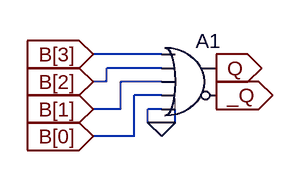
[diagram p0: schematic 4bit_or-fast.asc]
4bit_or-fast.asc, the LTspice schematic file:
Version 4
SHEET 1 880 680
WIRE 64 96 -16 96
WIRE 64 112 0 112
WIRE 0 128 0 112
WIRE 0 128 -16 128
WIRE 64 128 16 128
WIRE 64 144 32 144
WIRE 16 160 16 128
WIRE 16 160 -16 160
WIRE 64 160 48 160
WIRE 48 176 48 160
WIRE 64 176 48 176
WIRE 80 176 80 160
WIRE 80 176 64 176
WIRE 32 192 32 144
WIRE 32 192 -16 192
FLAG 128 112 Q
IOPIN 128 112 Out
FLAG -16 96 B[3]
IOPIN -16 96 In
FLAG -16 128 B[2]
IOPIN -16 128 In
FLAG -16 160 B[1]
IOPIN -16 160 In
FLAG -16 192 B[0]
IOPIN -16 192 In
FLAG 128 144 _Q
IOPIN 128 144 Out
FLAG 64 176 0
SYMBOL Digital\\or 96 64 R0
SYMATTR InstName A1

The netlist it stands for:
* 4bit_or-fast.asc
A1 B[3] B[2] B[1] B[0] 0 _Q Q 0 OR
.backanno
.end